# EAGLE design pi (EAGLE 9.6.2)
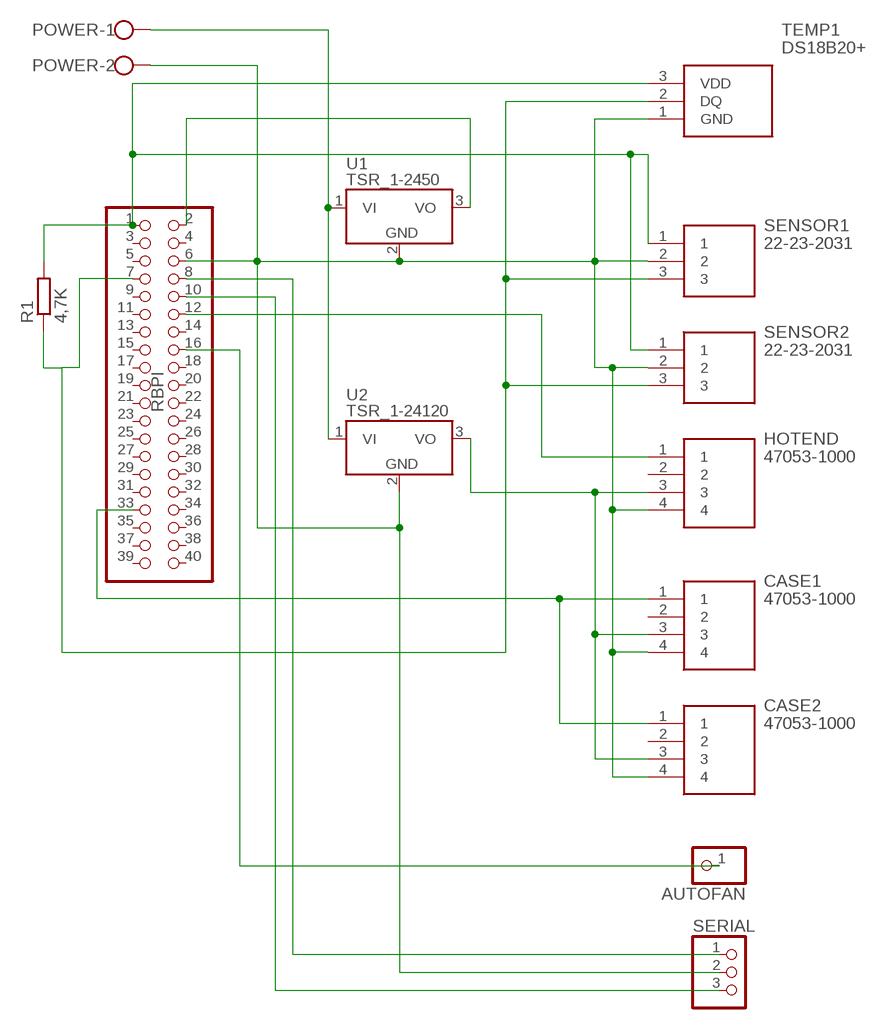
[diagram p0: schematic, sheet 1]

## Parts
AUTOFAN  PINHD-1X1  [1X01]
CASE1  47053-1000  [47053-1000]
CASE2  47053-1000  [47053-1000]
HOTEND  47053-1000  [47053-1000]
POWER  W237-102  [W237-102]
R1  4,7K  R-EU_0411/12  [0411/12]
RBPI  PINHD-2X20  [2X20]
SENSOR1  22-23-2031  [SHDR3W87P0X254_1X3_747X635X843]
SENSOR2  22-23-2031  [SHDR3W87P0X254_1X3_747X635X843]
SERIAL  PINHD-1X3  [1X03]
TEMP1  DS18B20+  [TO-92]
U1  TSR_1-2450  [TSR-1]
U2  TSR_1-24120  [TSR-1]

## Nets
N$1: CASE1.4 CASE2.4 HOTEND.4 POWER.2 RBPI.6 SENSOR1.2 SENSOR2.2 SERIAL.2 TEMP1.1(GND) U1.2(GND) U2.2(GND)
N$2: RBPI.2 U1.3(VO)
N$3: CASE1.3 CASE2.3 HOTEND.3 U2.3(VO)
N$4: R1.2 RBPI.1 SENSOR1.1 SENSOR2.1 TEMP1.3(VDD)
N$5: R1.1 RBPI.7 SENSOR1.3 SENSOR2.3 TEMP1.2(DQ)
N$6: HOTEND.1 RBPI.12
N$7: CASE1.1 CASE2.1 RBPI.33
N$8: AUTOFAN.1 RBPI.16
N$9: RBPI.8 SERIAL.1
N$10: RBPI.10 SERIAL.3
VI: POWER.1 U1.1(VI) U2.1(VI)
Unconnected: CASE1.2 CASE2.2 HOTEND.2 RBPI.3 RBPI.4 RBPI.5 RBPI.9 RBPI.11 RBPI.13 RBPI.14 RBPI.15 RBPI.17 RBPI.18 RBPI.19 RBPI.20 RBPI.21 RBPI.22 RBPI.23 RBPI.24 RBPI.25 RBPI.26 RBPI.27 RBPI.28 RBPI.29 RBPI.30 RBPI.31 RBPI.32 RBPI.34 RBPI.35 RBPI.36 RBPI.37 RBPI.38 RBPI.39 RBPI.40

## Library data of the parts
AUTOFAN = adafruit:PINHD-1X1: Pin header 1x1 for 0.1" spacing With round pins
CASE1 CASE2 HOTEND = SamacSys_Parts:47053-1000: MOLEX - 47053-1000 - HEADER, 4POS, 1ROW, 2.54MM Source: Datasheet <http://www.molex.com/pdm_docs/sd/470531000_sd.pdf>; DESCRIPTION: MOLEX - 47053-1000 - HEADER, 4POS, 1ROW, 2.54MM; HEIGHT: mm; MANUFACTURER_NAME: Molex; MANUFACTURER_PART_NUMBER: 47053-1000; MOUSER_PART_NUMBER: 538-47053-1000; MOUSER_PRICE-STOCK: https://www.mouser.co.uk/ProductDetail/Molex/47053-1000?qs=ph4zPCVRuvqoDX7hrEhxNA%3D%3D
POWER = con-wago-500:W237-102: WAGO SCREW CLAMP; MPN: 237-102; OC_FARNELL: unknown; OC_NEWARK: 70K9898
R1 = rcl:R-EU_: RESISTOR, European symbol; SPICEPREFIX: R
RBPI = adafruit:PINHD-2X20: PIN HEADER
SENSOR1 SENSOR2 = SamacSys_Parts:22-23-2031: 2.54mm,header,KK,vert,Sn,frictn lock,3w Molex KK 254 Series, Series Number 6373, 2.54mm Pitch 3 Way 1 Row Straight PCB Header, Through Hole, Solder Termination Source: Datasheet <http://www.molex.com/webdocs/datasheets/pdf/en-us//0022232031_PCB_HEADERS.pdf>; DESCRIPTION: 2.54mm,header,KK,vert,Sn,frictn lock,3w Molex KK 254 Series, Series Number 6373, 2.54mm Pitch 3 Way 1 Row Straight PCB Header, Through Hole, Solder Termination; HEIGHT: 8.43mm; MANUFACTURER_NAME: Molex; MANUFACTURER_PART_NUMBER: 22-23-2031; MOUSER_PART_NUMBER: 538-22-23-2031; MOUSER_PRICE-STOCK: https://www.mouser.co.uk/ProductDetail/Molex/22-23-2031?qs=ILqg114nvd41XyIAFDpXfw%3D%3D
SERIAL = adafruit:PINHD-1X3: PIN HEADER
TEMP1 = SamacSys_Parts:DS18B20+: DS18B20 prog thermometer 1-Wire, TO92 Source: Datasheet; DESCRIPTION: DS18B20 prog thermometer 1-Wire, TO92; HEIGHT: mm; MANUFACTURER_NAME: Maxim Integrated; MANUFACTURER_PART_NUMBER: DS18B20+; MOUSER_PART_NUMBER: 700-DS18B20+; MOUSER_PRICE-STOCK: https://www.mouser.co.uk/ProductDetail/Maxim-Integrated/DS18B20%2b?qs=7H2Jq%252ByxpJKegCKabDbglA%3D%3D
U1 U2 = _traco_tsr-1:TSR_1-*: TRACO TSR-1 Series Point-of-Load DC/DC-Converters Vi max. 36 V; Vo = (1.2 .. 15)V ±2%; Io = 0 .. 1 A SIP-Package (drop-in replacement for 78xx linear voltage regulators in TO220-package, vertically assembled) Source: www.tracopower.com Technologies: TSR 1- Vi (V) Vo (V) ±2% Io = 0 .. 1 A 24_ ( generic ) 2412 4.6 .. 36 1.2 2415 4.6 .. 36 1.5 2418 4.6 .. 36 1.8 2425 4.6 .. 36 2.5 2433 4.75.. 36 3.3 2450 6.5 .. 36 5.0 2465 9.0 .. 36 6.5 2490 12 .. 36 9.0 24120 15 .. 36 12 24150 18 .. 36 15 Author: Dipl.-Ing. FH Rainer Bayer HHN Hochschule Heilbronn, rainer.bayer@hs-heilbronn.de Ingenieurbüro ing-rb, mail@ing-rb.de

## Board
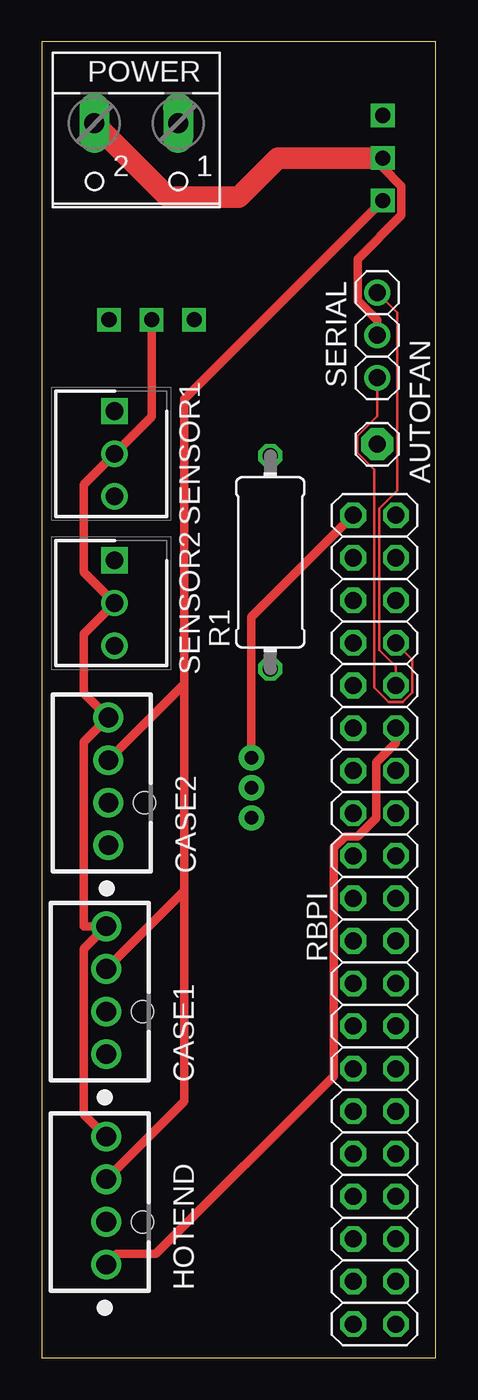
[diagram p1: board, top side]
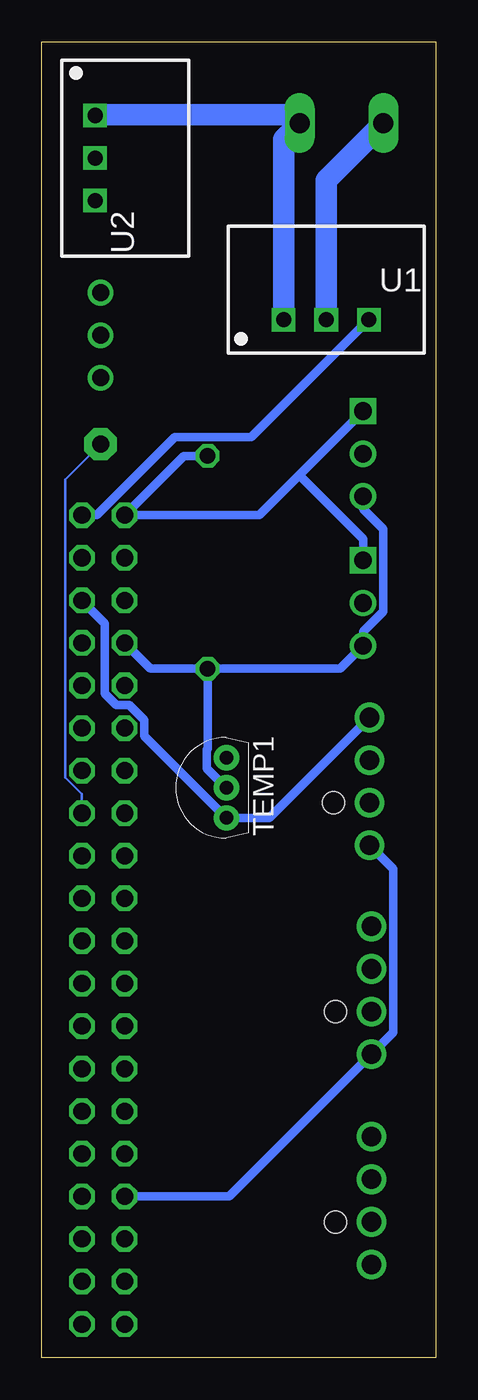
[diagram p2: board, bottom side, seen from below]

Size 23.5 x 78.5 mm. Coordinates in mm from the lower left corner, seen from the top.
Outline: 0,0 23.5,0 23.5,78.5 0,78.5 0,0
Copper layers (1*16): Top 0.035mm / dielectric 0.15mm / Bottom 0.035mm
Design rules "default": minimum track width 6mil, minimum drill 0.35mm, track to track 6mil, track to pad 6mil, pad to pad 6mil, via to via 6mil, smd to smd 6mil, copper to edge 40mil, drill to drill 6mil, minimum pad ring 10mil, minimum via ring 8mil, stop-mask expansion 4mil, vias tented up to drill 0mil, thermal gap 10mil

### Footprints (pad centres in the part's own frame; a part is rotated, then mirrored left to right if it is on the bottom)
1X01 = drill 1.016 pad 1.93 octagon: 1 0,0
47053-1000 = drill 1.17 pad 1.77: 1 1.57,2.54; 2 4.11,2.54; 3 6.65,2.54; 4 9.19,2.54 | hole 1.3: 4.11,0.38
W237-102 = drill 1.194 long: 1 -2.5,-1.27; 2 2.5,-1.27
0411/12 = drill 0.914 octagon: 1 -6.35,0; 2 6.35,0
2X20 = drill 1.016 octagon: 1 -24.13,-1.27; 2 -24.13,1.27; 3 -21.59,-1.27; 4 -21.59,1.27; 5 -19.05,-1.27; 6 -19.05,1.27; 7 -16.51,-1.27; 8 -16.51,1.27; 9 -13.97,-1.27; 10 -13.97,1.27; 11 -11.43,-1.27; 12 -11.43,1.27; 13 -8.89,-1.27; 14 -8.89,1.27; 15 -6.35,-1.27; 16 -6.35,1.27; 17 -3.81,-1.27; 18 -3.81,1.27; 19 -1.27,-1.27; 20 -1.27,1.27; 21 1.27,-1.27; 22 1.27,1.27; 23 3.81,-1.27; 24 3.81,1.27; 25 6.35,-1.27; 26 6.35,1.27; 27 8.89,-1.27; 28 8.89,1.27; 29 11.43,-1.27; 30 11.43,1.27; 31 13.97,-1.27; 32 13.97,1.27; 33 16.51,-1.27; 34 16.51,1.27; 35 19.05,-1.27; 36 19.05,1.27; 37 21.59,-1.27; 38 21.59,1.27; 39 24.13,-1.27; 40 24.13,1.27
SHDR3W87P0X254_1X3_747X635X843 = drill 1.05 pad 1.575 square: 1 0,0 | drill 1.05 pad 1.575: 2 -2.54,0; 3 -5.08,0
1X03 = drill 1.016: 1 -2.54,0; 2 0,0; 3 2.54,0
TO-92 = drill 0.81 pad 1.51: 1 0,-1.8; 2 0,0; 3 0,1.8
TSR-1 = drill 0.9 square: 1 -2.54,0; 2 0,0; 3 2.54,0

### Placement (x,y rotation side)
AUTOFAN  20,54.5 0 top
CASE1  6.38,16.54 90 top
CASE2  6.5,29 90 top
HOTEND  6.38,3.99 90 top
POWER  5.63,72.38 180 top
R1  13.62,47.45 90 top
RBPI  19.84,26.13 270 top
SENSOR1  4.34,56.47 90 top
SENSOR2  4.34,47.56 90 top
SERIAL  20,61 90 top
TEMP1  12.5,34 0 bottom
U1  6.54,61.92 0 bottom
U2  20.33,71.57 270 bottom

### Tracks (layer width: path | path; a pad name or v marks a point on that pad's centre or on a via)
N$1
  Top 0.508: HOTEND.4 2.5,14.52 2.5,24.39 CASE1.4 2.5,25.73 2.5,36.73 CASE2.4 2.5,39.65 2.5,43.18 SENSOR2.2 2.5,46.86 2.5,52.09 SENSOR1.2 6.54,56.13 U1.2 | SERIAL.2 20,61.89 18.83,63.06 18.83,65.55 21.44,68.16 21.44,69.9 20.33,71.01 U2.2
  Top 1.27: POWER.2 7.54,69.24 11.74,69.24 14.07,71.57 U2.2
  Bottom 0.508: CASE2.4 9.95,32.2 TEMP1.1 17.4,37.1 17.4,38.04 18.29,38.93 19.05,38.93 19.74,39.62 19.74,43.81 RBPI.6
  Bottom 1.27: POWER.2 6.54,70.24 U1.2
N$2
  Bottom 0.508: U1.3 11,54.92 15.57,54.92 20.22,50.26 RBPI.2
N$3
  Top 0.508: 8.5,40.19 CASE2.3 | 8.5,40.19 8.5,57.2 U2.3 | 8.5,40.19 8.5,27.85 | 8.5,27.85 CASE1.3 | 8.5,27.85 8.5,15.3 HOTEND.3
N$4
  Top 0.508: TEMP1.3 12.5,44.19 RBPI.1
  Bottom 0.508: 8.15,52.66 10.55,50.26 RBPI.1 15.03,53.8 R1.2 | 8.15,52.66 SENSOR1.1 | SENSOR2.1 4.34,48.84 8.15,52.66
N$5
  Bottom 0.508: SENSOR1.3 4.34,50.64 3.15,49.44 3.15,44.52 4.34,43.33 SENSOR2.3 5.72,41.1 R1.1 | R1.1 17.03,41.1 RBPI.7 | R1.1 13.62,36.32 13.66,36.28 13.66,35.16 TEMP1.2
N$6
  Top 0.508: HOTEND.1 4.46,6.18 6.79,6.18 17.4,16.79 17.4,30.42 18.09,31.11 18.85,31.11 19.94,32.2 19.94,35.5 21.11,36.67 RBPI.12
N$7
  Bottom 0.508: RBPI.33 12.33,9.62 CASE1.1 2.55,19.4 2.55,29.16 CASE2.1
N$8
  Bottom 0.152: RBPI.16 21.11,33.62 22.1,34.61 22.1,52.4 AUTOFAN.1
N$9
  Top 0.152: SERIAL.1 20,56.19 18.81,54.99 18.81,54.01 19.82,53 19.82,39.99 20.7,39.11 21.52,39.11 22.1,39.69 22.1,41.65 RBPI.8
N$10
  Top 0.152: RBPI.10 21.11,41.24 20.12,42.23 20.12,50.67 21.19,51.74 21.19,62.35 SERIAL.3
VI
  Bottom 1.27: U2.1 20.29,74.15 8.63,74.15 POWER.1 9.08,72.7 U1.1